# Altium project soldering_station.PrjPcb
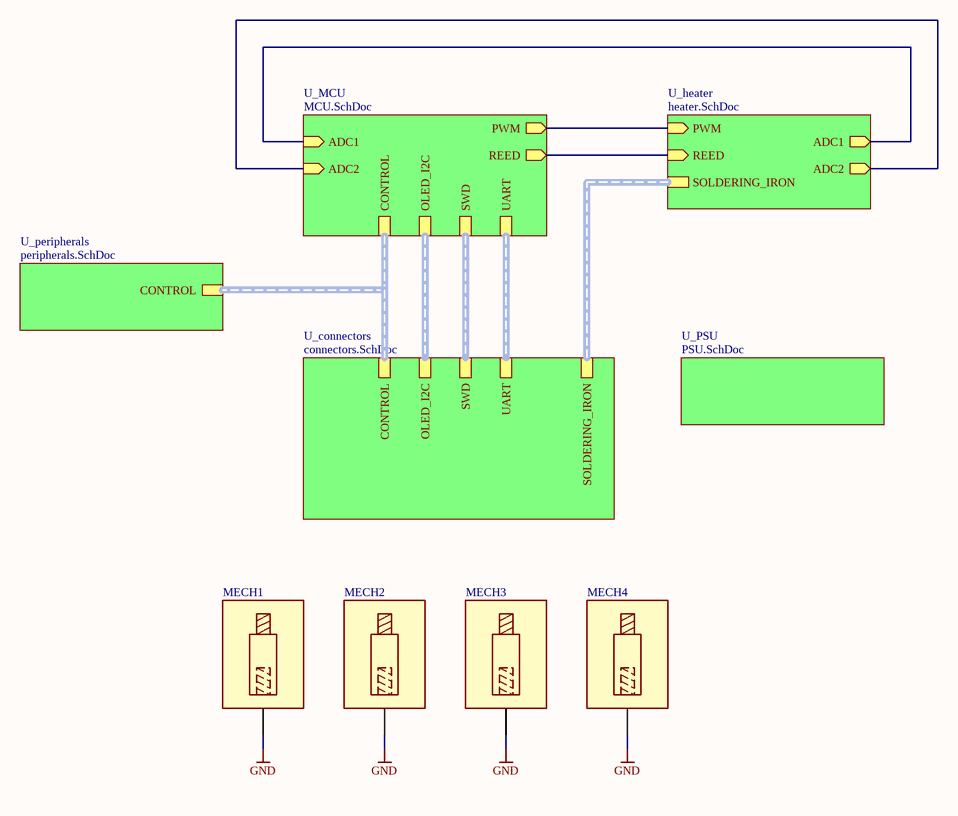
[diagram p0: top.SchDoc]
6 sheets, 88 parts. Net scope: hierarchical (ports join the sheet entries above them; power ports are global).
Board file: soldering_station.PcbDoc
Sheets:
  top.SchDoc
    U_PSU = PSU.SchDoc
    U_MCU = MCU.SchDoc
    U_connectors = connectors.SchDoc
    U_heater = heater.SchDoc
    U_peripherals = peripherals.SchDoc

## Sheet top.SchDoc
size A4

### Parts
MECH1  M3X0.5  [MECH_SPACER_MALE_FEMALE_18MM_M3]  (value not drawn)
MECH2  M3X0.5  [MECH_SPACER_MALE_FEMALE_18MM_M3]  (value not drawn)
MECH3  M3X0.5  [MECH_SPACER_MALE_FEMALE_18MM_M3]  (value not drawn)
MECH4  M3X0.5  [MECH_SPACER_MALE_FEMALE_18MM_M3]  (value not drawn)

### Sub-sheets
U_connectors = connectors.SchDoc: SWD (harness SWD), CONTROL (harness CONTROL), OLED_I2C (harness OLED_I2C), UART (harness UART), SOLDERING_IRON (harness SOLDERING_IRON)
U_heater = heater.SchDoc: PWM (in), ADC2 (out), ADC1 (out), SOLDERING_IRON (harness SOLDERING_IRON), REED (in)
U_MCU = MCU.SchDoc: SWD (harness SWD), PWM (out), CONTROL (harness CONTROL), OLED_I2C (harness OLED_I2C), UART (harness UART), ADC2 (in), ADC1 (in), REED (out)
U_peripherals = peripherals.SchDoc: CONTROL (harness CONTROL)
U_PSU = PSU.SchDoc: no entries

### Nets
GND: MECH1.1 MECH2.1 MECH3.1 MECH4.1
PWM_OUT: sheet U_MCU/PWM, sheet U_heater/PWM
REED: sheet U_MCU/REED, sheet U_heater/REED
TR: sheet U_MCU/ADC2, sheet U_heater/ADC2
NetR9_2: sheet U_MCU/ADC1, sheet U_heater/ADC1

### Buses and harness runs
harness sheet U_connectors/CONTROL = sheet U_MCU/CONTROL = sheet U_peripherals/CONTROL
harness sheet U_connectors/OLED_I2C = sheet U_MCU/OLED_I2C
harness sheet U_connectors/SOLDERING_IRON = sheet U_heater/SOLDERING_IRON
harness sheet U_connectors/SWD = sheet U_MCU/SWD
harness sheet U_connectors/UART = sheet U_MCU/UART

### Library data of the parts
MECH1-MECH4 = MECH_SPACER_MALE_FEMALE_18MM_M3: Manufacturer: FIX&FASTEN; Value: TP-18; SCH_Footprint: M3; Part Number: MECH_SPACER_MALE_FEMALE_18MM_M3; HelpURL: http://www.tme.eu/pl/Document/c63f116060195082d899531b8f30ddf7/TP-10.pdf; Manufacturer Part Number: TP-18; Supplier 1: TME; Supplier Part Number 1: TP-18; Supplier 2: RS Components; Supplier 3: Farnell; Supplier 4: Mouser; Supplier 5: Digi-Key

## Sheet PSU.SchDoc
size A4
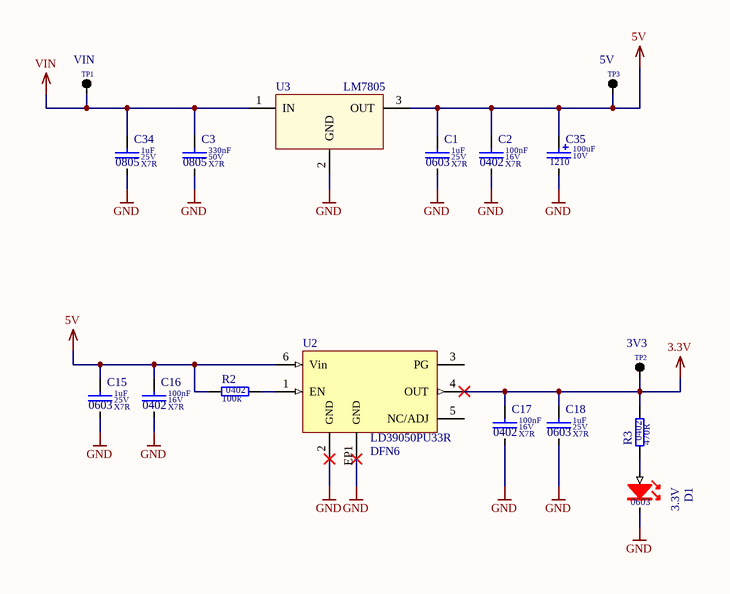
[diagram p1: PSU.SchDoc]

### Parts
C1  value 1uF  Dielectric: X7R  Voltage: 25V  SCH_Footprint: 0603  [C_0603_1608]  (hidden comment: Ceramic X7R)
C2  value 100nF  Dielectric: X7R  Voltage: 16V  SCH_Footprint: 0402  [C_0402_1005]  (hidden comment: Ceramic X7R)
C3  value 330nF  Dielectric: X7R  Voltage: 50V  SCH_Footprint: 0805  [C_0805_2012]  (hidden comment: Ceramic X7R)
C15  value 1uF  Dielectric: X7R  Voltage: 25V  SCH_Footprint: 0603  [C_0603_1608]  (hidden comment: Ceramic X7R)
C16  value 100nF  Dielectric: X7R  Voltage: 16V  SCH_Footprint: 0402  [C_0402_1005]  (hidden comment: Ceramic X7R)
C17  value 100nF  Dielectric: X7R  Voltage: 16V  SCH_Footprint: 0402  [C_0402_1005]  (hidden comment: Ceramic X7R)
C18  value 1uF  Dielectric: X7R  Voltage: 25V  SCH_Footprint: 0603  [C_0603_1608]  (hidden comment: Ceramic X7R)
C34  value 1uF  Dielectric: X7R  Voltage: 25V  SCH_Footprint: 0805  [C_0805_2012]  (hidden comment: Ceramic X7R)
C35  value 100uF  SCH_Footprint: 1210  Voltage: 10V  [CT_1210_3225]  (hidden comment: Tantalum Capacitor)
D1  3.3V  SCH_Footprint: 0603  [OL_0603_1608]
R2  value 100k  SCH_Footprint: 0402  [R_0402_1005]  (hidden comment: Resistor)
R3  value 470R  SCH_Footprint: 0402  [R_0402_1005]  (hidden comment: Resistor)
TP1  VIN  [TP_PAD]
TP2  3V3  [TP_PAD]
TP3  5V  [TP_PAD]
U2  SCH_Footprint: DFN6  [DFN6_3x3]  (hidden comment: LD39050PU33R)
U3  LM7805  [LM7805]

### Nets
3.3V: C17.1 C18.1 R3.2 TP2.1(TP) U2.4(OUT)
5V: C1.1 C2.1 C15.1 C16.1 C35.1 R2.1 TP3.1(TP) U2.6(Vin) U3.3(OUT)
GND: C1.2 C2.2 C3.2 C15.2 C16.2 C17.2 C18.2 C34.2 C35.2 D1.1(K) U2.2(GND) U2.EP1(GND) U3.2(GND)
VIN: C3.1 C34.1 TP1.1(TP) U3.1(IN)
NetD1_2: D1.2(A) R3.1
NetR2_2: R2.2 U2.1(EN)

Not connected (* = marked no-connect by the designer): U2 3(PG) 5(NC/ADJ)

### Library data of the parts
C1 C15 C18 = C_1uF_25V_X7R_0603_10: Capacitor; Manufacturer: Samsung; Manufacturer Part Number: CL10B105KA8NNNC; Tolerance (%): 10; Part Number: C_1uF_25V_X7R_0603_10; HelpURL: http://www.tme.eu/pl/Document/4a42202b32dab16128fe107dd69598cc/samsung-chip-cap.pdf; Supplier 1: TME; Supplier Part Number 1: CL10B105KA8NNNC; Supplier 2: RS Components; Supplier 3: Farnell; Supplier 4: Mouser; Supplier 5: Digi-Key
C2 C16 C17 = C_100nF_16V_X7R_0402_10: Capacitor; Manufacturer: Murata; Manufacturer Part Number: GRM155R71C104KA88D; Tolerance (%): 10; Part Number: C_100nF_16V_X7R_0402_10; HelpURL: https://www.mouser.com/ds/2/281/c02e-2905.pdf; Supplier 1: TME; Supplier 2: RS Components; Supplier 3: Farnell; Supplier 4: Mouser; Supplier Part Number 4: 81-GRM155R71C104KA88; Supplier 5: Digi-Key
C3 C34 = C_2.2uF_25V_X7R_0805_10: Capacitor; Manufacturer: Murata; Manufacturer Part Number: GCM21BR71E225KA73L; Tolerance (%): 10; Part Number: C_2.2uF_25V_X7R_0805_10; HelpURL: http://www.tme.eu/pl/Document/8ba767cb01dfa0e767d35427fa0d0fc6/GCM21BR71E225KA73-01.pdf; Supplier 1: TME; Supplier Part Number 1: GCM21BR71E225KA73L; Supplier 2: RS Components; Supplier Part Number 2: 7235045; Supplier 3: Farnell; Supplier Part Number 3: 2470436; Supplier 4: Mouser; Supplier Part Number 4: 81-81-GCM21BR71E225KA3L; Supplier 5: Digi-Key; Supplier Part Number 5: 490-4787-1-ND
C35 = CT_100uF_10V_TA2O5_1210_20: Capacitor; Manufacturer: AVX; Manufacturer Part Number: TAJB107M010RNJ; Dielectric: TA2O5; Tolerance (%): 20; Part Number: CT_100uF_10V_TA2O5_1210_20; HelpURL: https://datasheet.octopart.com/TAJB107M010RNJ-AVX-datasheet-12511273.pdf; Supplier 1: TME; Supplier Part Number 1: TAJB107M010R; Supplier 2: RS Components; Supplier Part Number 2: 1360118; Supplier 3: Farnell; Supplier Part Number 3: 1658150; Supplier 4: Mouser; Supplier Part Number 4: 581-TAJB107M010R; Supplier 5: Digi-Key; Supplier Part Number 5: 478-5801-1-ND
D1 = OL_R_0603: LED_RED; Manufacturer: Lite-On; Value: LTST-C190KRKT; Part Number: OL_R_0603; HelpURL: https://datasheet.octopart.com/LTST-C190KRKT-Lite-On-datasheet-158191.pdf; Manufacturer Part Number: LTST-C190KRKT; Supplier 1: TME; Supplier Part Number 1: LTST-C190KRKT; Supplier 2: RS Components; Supplier Part Number 2: 1769795; Supplier 3: Farnell; Supplier 4: Mouser; Supplier Part Number 4: 859-LTST-C190KRKT; Supplier 5: Digi-Key; Supplier Part Number 5: 160-1436-1-ND
R2 = R_100k_0402_1: Manufacturer: Yageo; Manufacturer Part Number: RC0402FR-07100KL; Voltage: 50V; Power: 63mW; Tolerance: 1%; Part Number: R_100k_0402_1; HelpURL: http://www.tme.eu/pl/Document/1a2bc76e2be68b3b1670068306778ce6/rc0402yageo.pdf; Supplier 1: TME; Supplier Part Number 1: RC0402FR-07100K; Supplier 2: RS Components; Supplier 3: Farnell; Supplier Part Number 3: 2131798; Supplier 4: Mouser; Supplier Part Number 4: 603-RC0402FR-07100KL; Supplier 5: Digi-Key; Supplier Part Number 5: 311-100KLRCT-ND
R3 = R_470R_0402_1: Manufacturer: Yageo; Manufacturer Part Number: RC0402FR-07470RL; Voltage: 50V; Power: 63mW; Tolerance: 1%; Part Number: R_470R_0402_1; HelpURL: http://datasheet.octopart.com/RC0402FR-07470RL-Yageo-datasheet-10408619.pdf; Supplier 1: TME; Supplier Part Number 1: RC0402FR-07470R; Supplier 2: RS Components; Supplier 3: Farnell; Supplier Part Number 3: 9239197; Supplier 4: Mouser; Supplier Part Number 4: 603-RC0402FR-07470RL; Supplier 5: Digi-Key; Supplier Part Number 5: 311-470LRCT-ND
TP1-TP3 = TP_PAD: Testpoint; SCH_Footprint: SMD; Part Number: TP_PAD; Component Type: Standard (No BOM); Supplier 1: TME; Supplier 2: RS Components; Supplier 3: Farnell; Supplier 4: Mouser; Supplier 5: Digi-Key
U2 = VL_LD39050PU33R: Manufacturer: STMicroelectronics; Voltage: 3.3V; Current: 500mA; Value: LD39050PU33R; Part Number: VL_LD39050PU33R; HelpURL: https://www.tme.eu/pl/Document/062513da0f421ddb82a14a498f7bf1c8/LD39050.pdf; Manufacturer Part Number: LD39050PU33R; Supplier 1: TME; Supplier Part Number 1: LD39050PU33R; Supplier 2: RS Components; Supplier 3: Farnell; Supplier Part Number 3: 2762703; Supplier 4: Mouser; Supplier Part Number 4: 511-LD39050PU33R; Supplier 5: Digi-Key; Supplier Part Number 5: 497-8716-1-ND
U3 = LM7805: linear voltage stabilizer

## Sheet MCU.SchDoc
size A4
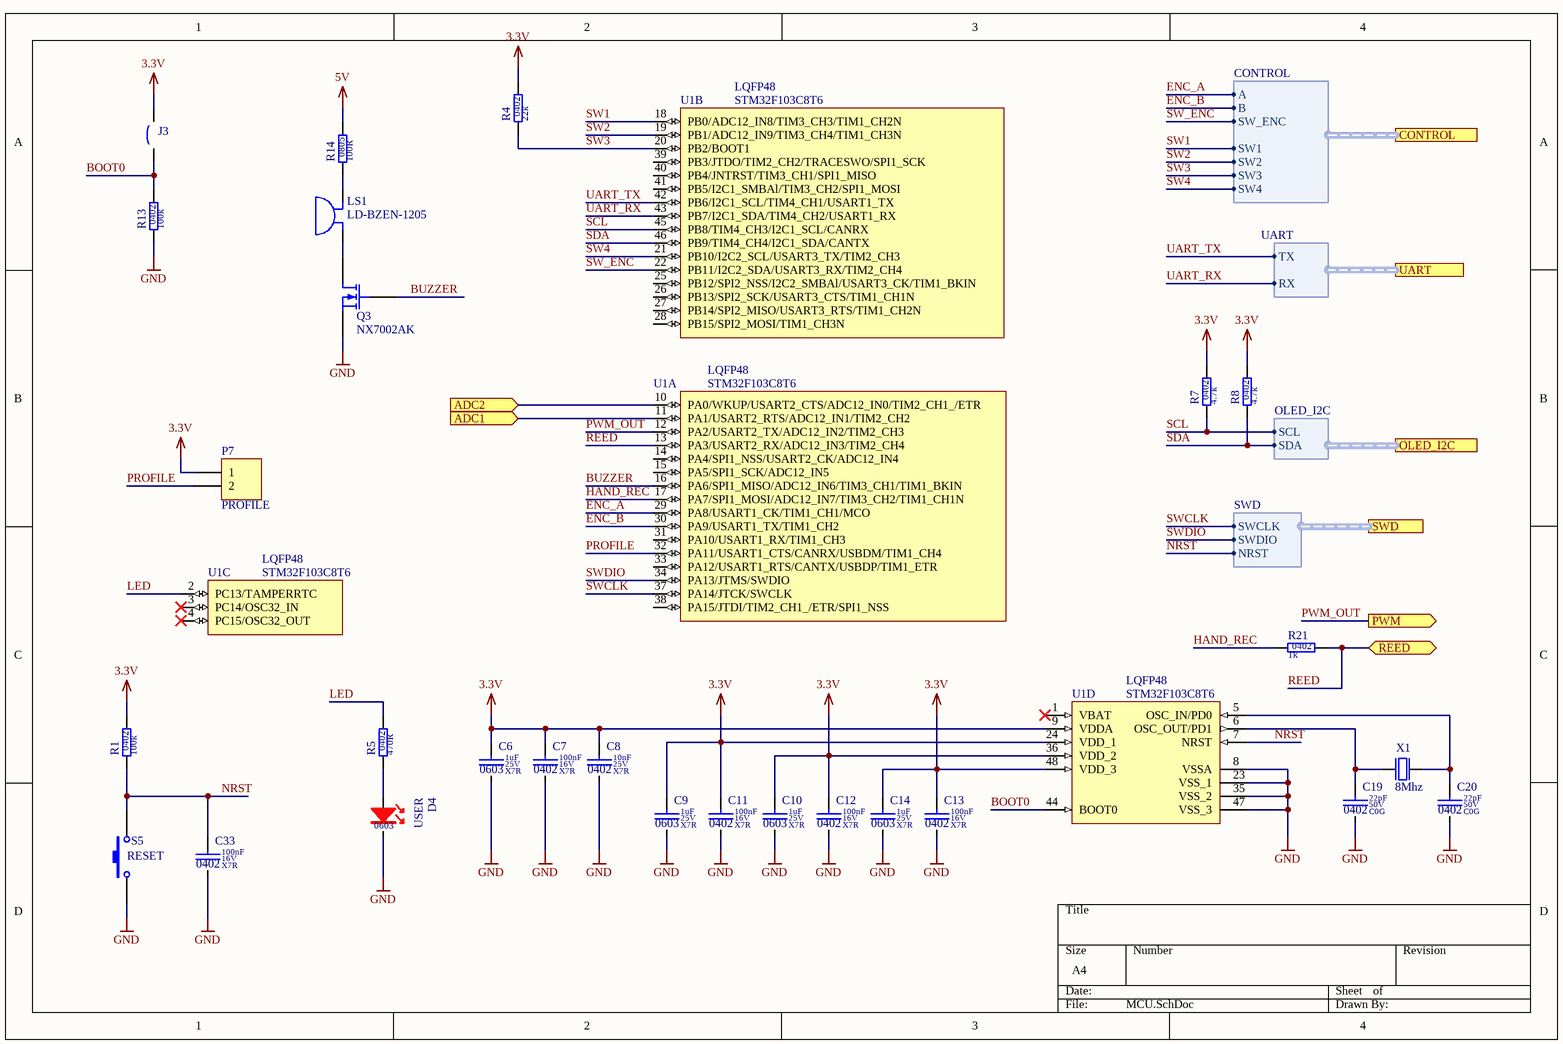
[diagram p2: MCU.SchDoc]

### Parts
C6  value 1uF  Dielectric: X7R  Voltage: 25V  SCH_Footprint: 0603  [C_0603_1608]  (hidden comment: Ceramic X7R)
C7  value 100nF  Dielectric: X7R  Voltage: 16V  SCH_Footprint: 0402  [C_0402_1005]  (hidden comment: Ceramic X7R)
C8  value 10nF  Dielectric: X7R  Voltage: 25V  SCH_Footprint: 0402  [C_0402_1005]  (hidden comment: Ceramic X7R)
C9  value 1uF  Dielectric: X7R  Voltage: 25V  SCH_Footprint: 0603  [C_0603_1608]  (hidden comment: Ceramic X7R)
C10  value 1uF  Dielectric: X7R  Voltage: 25V  SCH_Footprint: 0603  [C_0603_1608]  (hidden comment: Ceramic X7R)
C11  value 100nF  Dielectric: X7R  Voltage: 16V  SCH_Footprint: 0402  [C_0402_1005]  (hidden comment: Ceramic X7R)
C12  value 100nF  Dielectric: X7R  Voltage: 16V  SCH_Footprint: 0402  [C_0402_1005]  (hidden comment: Ceramic X7R)
C13  value 100nF  Dielectric: X7R  Voltage: 16V  SCH_Footprint: 0402  [C_0402_1005]  (hidden comment: Ceramic X7R)
C14  value 1uF  Dielectric: X7R  Voltage: 25V  SCH_Footprint: 0603  [C_0603_1608]  (hidden comment: Ceramic X7R)
C19  value 22pF  Dielectric: C0G  Voltage: 50V  SCH_Footprint: 0402  [C_0402_1005]  (hidden comment: Ceramic C0G)
C20  value 22pF  Dielectric: C0G  Voltage: 50V  SCH_Footprint: 0402  [C_0402_1005]  (hidden comment: Ceramic C0G)
C33  value 100nF  Dielectric: X7R  Voltage: 16V  SCH_Footprint: 0402  [C_0402_1005]  (hidden comment: Ceramic X7R)
D4  USER  SCH_Footprint: 0603  [OL_0603_1608]
J3  BOOT0  [Contact_Point_2_Pad]  (value not drawn)
LS1  LD-BZEN-1205  [LD-BZEN-1205]
P7  PROFILE  [P_HEADER_1x2_2.54]
Q3  NX7002AK  [NX7002AK.215]
R1  value 100k  SCH_Footprint: 0402  [R_0402_1005]  (hidden comment: Resistor)
R4  value 22k  SCH_Footprint: 0402  [R_0402_1005]  (hidden comment: Resistor)
R5  value 470R  SCH_Footprint: 0402  [R_0402_1005]  (hidden comment: Resistor)
R7  value 4.7k  SCH_Footprint: 0402  [R_0402_1005]  (hidden comment: Resistor)
R8  value 4.7k  SCH_Footprint: 0402  [R_0402_1005]  (hidden comment: Resistor)
R13  value 100k  SCH_Footprint: 0402  [R_0402_1005]  (hidden comment: Resistor)
R14  value 100R  SCH_Footprint: 0805  [R_0805_2012]  (hidden comment: Resistor)
R21  value 1k  SCH_Footprint: 0402  [R_0402_1005]  (hidden comment: Resistor)
S5  RESET  [S_TACTSWITCH3x6]
U1  SCH_Footprint: LQFP48  [LQFP48_7x7]  (hidden comment: STM32F103C8T6)  (parts A,B,C,D of 4)
X1  8MHz  [X_HC49_THT]

### Ports
ADC1 (in), ADC2 (in), CONTROL (harness CONTROL), OLED_I2C (harness OLED_I2C), PWM (out), REED (bidir), SWD (harness SWD), UART (harness UART)

### Harnesses
SWD: SWCLK, NRST, SWDIO
CONTROL: A, B, SW_ENC, SW1, SW2, SW3, SW4
OLED_I2C: SCL, SDA
UART: TX, RX

### Nets
3.3V: C6.1 C7.1 C8.1 C9.1 C10.1 C11.1 C12.1 C13.1 C14.1 J3.2 P7.1 R1.2 R4.2 R7.2 R8.2 U1.9(VDDA) U1.24(VDD_1) U1.36(VDD_2) U1.48(VDD_3)
5V: R14.2
GND: C6.2 C7.2 C8.2 C9.2 C10.2 C11.2 C12.2 C13.2 C14.2 C19.2 C20.2 C33.2 D4.1(K) Q3.2(S) R13.1 S5.1 U1.8(VSSA) U1.23(VSS_1) U1.35(VSS_2) U1.47(VSS_3)
BOOT0: J3.1 R13.2 U1.44(BOOT0)
BUZZER: Q3.1(G) U1.16(PA6/SPI1_MISO/ADC12_IN6/TIM3_CH1/TIM1_BKIN)
ENC_A: U1.29(PA8/USART1_CK/TIM1_CH1/MCO) ; port CONTROL.A
ENC_B: U1.30(PA9/USART1_TX/TIM1_CH2) ; port CONTROL.B
HAND_REC: R21.1 U1.17(PA7/SPI1_MOSI/ADC12_IN7/TIM3_CH2/TIM1_CH1N)
LED: R5.2 U1.2(PC13/TAMPERRTC)
NRST: C33.1 R1.1 S5.2 U1.7(NRST) ; port SWD.NRST
PROFILE: P7.2 U1.32(PA11/USART1_CTS/CANRX/USBDM/TIM1_CH4)
PWM_OUT: U1.12(PA2/USART2_TX/ADC12_IN2/TIM2_CH3) ; port PWM
REED: R21.2 U1.13(PA3/USART2_RX/ADC12_IN3/TIM2_CH4) ; port REED
SCL: R7.1 U1.45(PB8/TIM4_CH3/I2C1_SCL/CANRX) ; port OLED_I2C.SCL
SDA: R8.1 U1.46(PB9/TIM4_CH4/I2C1_SDA/CANTX) ; port OLED_I2C.SDA
SW1: U1.18(PB0/ADC12_IN8/TIM3_CH3/TIM1_CH2N) ; port CONTROL.SW1
SW2: U1.19(PB1/ADC12_IN9/TIM3_CH4/TIM1_CH3N) ; port CONTROL.SW2
SW3: R4.1 U1.20(PB2/BOOT1) ; port CONTROL.SW3
SW4: U1.21(PB10/I2C2_SCL/USART3_TX/TIM2_CH3) ; port CONTROL.SW4
SW_ENC: U1.22(PB11/I2C2_SDA/USART3_RX/TIM2_CH4) ; port CONTROL.SW_ENC  [project net SW]
SWCLK: U1.37(PA14/JTCK/SWCLK) ; port SWD.SWCLK
SWDIO: U1.34(PA13/JTMS/SWDIO) ; port SWD.SWDIO
TR: U1.10(PA0/WKUP/USART2_CTS/ADC12_IN0/TIM2_CH1_/ETR) ; port ADC2
UART_RX: U1.43(PB7/I2C1_SDA/TIM4_CH2/USART1_RX) ; port UART.RX  [project net RX]
UART_TX: U1.42(PB6/I2C1_SCL/TIM4_CH1/USART1_TX) ; port UART.TX  [project net TX]
NetC19_1: C19.1 U1.6(OSC_OUT/PD1) X1.1
NetC20_1: C20.1 U1.5(OSC_IN/PD0) X1.2
NetD4_2: D4.2(A) R5.1
NetLS1_1: LS1.1 R14.1
NetLS1_2: LS1.2 Q3.3(D)
NetR9_2: U1.11(PA1/USART2_RTS/ADC12_IN1/TIM2_CH2) ; port ADC1

Not connected (* = marked no-connect by the designer): U1 1(VBAT)* 3(PC14/OSC32_IN)* 4(PC15/OSC32_OUT)* 14(PA4/SPI1_NSS/USART2_CK/ADC12_IN4) 15(PA5/SPI1_SCK/ADC12_IN5) 25(PB12/SPI2_NSS/I2C2_SMBAl/USART3_CK/TIM1_BKIN) 26(PB13/SPI2_SCK/USART3_CTS/TIM1_CH1N) 27(PB14/SPI2_MISO/USART3_RTS/TIM1_CH2N) 28(PB15/SPI2_MOSI/TIM1_CH3N) 31(PA10/USART1_RX/TIM1_CH3) 33(PA12/USART1_RTS/CANTX/USBDP/TIM1_ETR) 38(PA15/JTDI/TIM2_CH1_/ETR/SPI1_NSS) 39(PB3/JTDO/TIM2_CH2/TRACESWO/SPI1_SCK) 40(PB4/JNTRST/TIM3_CH1/SPI1_MISO) 41(PB5/I2C1_SMBAl/TIM3_CH2/SPI1_MOSI)

### Library data of the parts
C6 C9 C10 C14 = C_1uF_25V_X7R_0603_10: as C1 on sheet PSU; Part Number: C_1uF_25V_X7R_0603_10; HelpURL: http://www.tme.eu/pl/Document/4a42202b32dab16128fe107dd69598cc/samsung-chip-cap.pdf; Supplier 1: TME; Supplier Part Number 1: CL10B105KA8NNNC; Supplier 2: RS Components; Supplier 3: Farnell; Supplier 4: Mouser; Supplier 5: Digi-Key
C7 C11-C13 C33 = C_100nF_16V_X7R_0402_10: as C2 on sheet PSU; Part Number: C_100nF_16V_X7R_0402_10; HelpURL: https://www.mouser.com/ds/2/281/c02e-2905.pdf; Supplier 1: TME; Supplier 2: RS Components; Supplier 3: Farnell; Supplier 4: Mouser; Supplier Part Number 4: 81-GRM155R71C104KA88; Supplier 5: Digi-Key
C8 = C_10nF_25V_X7R_0402_10: Capacitor; Manufacturer: Murata; Manufacturer Part Number: GRM155R71E103KA01D; Tolerance (%): 10; Part Number: C_10nF_25V_X7R_0402_10; HelpURL: http://www.tme.eu/en/Document/e3e731e59cc68b1ab6d46b158bb05733/MURATA_GRM.pdf; Supplier 1: TME; Supplier Part Number 1: GRM155R71E103KA01D; Supplier 2: RS Components; Supplier Part Number 2: 6242301; Supplier 3: Farnell; Supplier Part Number 3: 8819734; Supplier 4: Mouser; Supplier Part Number 4: 81-GRM36X103K25; Supplier 5: Digi-Key; Supplier Part Number 5: 490-1312-1-ND
C19 C20 = C_22pF_50V_C0G_0402_5: Capacitor; Manufacturer: AVX; Manufacturer Part Number: 04025A220JAT2A; Tolerance (%): 5; Part Number: C_22pF_50V_C0G_0402_5; HelpURL: http://datasheet.octopart.com/04025A220JAT2A-AVX-datasheet-9883399.pdf; Supplier 1: TME; Supplier Part Number 1: 04025A220JAT2A; Supplier 2: RS Components; Supplier Part Number 2: 6983087; Supplier 3: Farnell; Supplier Part Number 3: 2280776; Supplier 4: Mouser; Supplier Part Number 4: 581-04025A220J; Supplier 5: Digi-Key; Supplier Part Number 5: 478-1074-1-ND
D4 = OL_R_0603: as D1 on sheet PSU; Part Number: OL_R_0603; HelpURL: https://datasheet.octopart.com/LTST-C190KRKT-Lite-On-datasheet-158191.pdf; Manufacturer Part Number: LTST-C190KRKT; Supplier 1: TME; Supplier Part Number 1: LTST-C190KRKT; Supplier 2: RS Components; Supplier Part Number 2: 1769795; Supplier 3: Farnell; Supplier 4: Mouser; Supplier Part Number 4: 859-LTST-C190KRKT; Supplier 5: Digi-Key; Supplier Part Number 5: 160-1436-1-ND
J3 = Contact_Point_2_Pad
LS1 = LD-BZEN-1205: Przetwornik dźwięku: elektromagnetyczny; THT; 2,4kHz; 40mA; H: 9mm
P7 = P_HEADER_1x2_2.54: Header, 2-Pin; Manufacturer: Connfly; Value: DS1021-1*2SF1-1; SCH_Footprint: 1x2 2.54mm; Part Number: P_HEADER_1x2_2.54; Component Type: Standard; HelpURL: http://www.tme.eu/en/Document/cc301e58a5da78cb543a94b5a5b7f06a/DS1021.pdf; Manufacturer Part Number: DS1021-1*2SF1-1; Supplier 1: TME; Supplier Part Number 1: ZL201-02G; Supplier 2: RS Components; Supplier 3: Farnell; Supplier 4: Mouser; Supplier 5: Digi-Key
Q3 = NX7002AK.215: Tranzystor: N-MOSFET; unipolarny; 60V; 0,12A; 325mW; SOT23
R1 R7 R8 R13 = R_100k_0402_1: as R2 on sheet PSU; Part Number: R_100k_0402_1; HelpURL: http://www.tme.eu/pl/Document/1a2bc76e2be68b3b1670068306778ce6/rc0402yageo.pdf; Supplier 1: TME; Supplier Part Number 1: RC0402FR-07100K; Supplier 2: RS Components; Supplier 3: Farnell; Supplier Part Number 3: 2131798; Supplier 4: Mouser; Supplier Part Number 4: 603-RC0402FR-07100KL; Supplier 5: Digi-Key; Supplier Part Number 5: 311-100KLRCT-ND
R4 = R_22k_0402_1: Manufacturer: Panasonic; Manufacturer Part Number: ERA-2AEB223X; Voltage: 50V; Power: 63mW; Tolerance: 1%; Part Number: R_22k_0402_1; HelpURL: http://www.mouser.com/ds/2/315/AOA0000C237-1100991.pdf; Supplier 1: TME; Supplier 2: RS Components; Supplier Part Number 2: 566557; Supplier 3: Farnell; Supplier Part Number 3: 1577719; Supplier 4: Mouser; Supplier Part Number 4: 667-ERA-2AEB223X; Supplier 5: Digi-Key; Supplier Part Number 5: P22KDCCT-ND
R5 = R_470R_0402_1: as R3 on sheet PSU; Part Number: R_470R_0402_1; HelpURL: http://datasheet.octopart.com/RC0402FR-07470RL-Yageo-datasheet-10408619.pdf; Supplier 1: TME; Supplier Part Number 1: RC0402FR-07470R; Supplier 2: RS Components; Supplier 3: Farnell; Supplier Part Number 3: 9239197; Supplier 4: Mouser; Supplier Part Number 4: 603-RC0402FR-07470RL; Supplier 5: Digi-Key; Supplier Part Number 5: 311-470LRCT-ND
R14 = R_100R_0805_1: Manufacturer: Yageo; Manufacturer Part Number: RC0805FR-07100RL; Voltage: 150V; Power: 125mW; Tolerance: 1%; Part Number: R_100R_0805_1; HelpURL: https://www.tme.eu/pl/Document/7b8fed8c112f8a94930279c22c957f7f/rc0805yageo.pdf; Supplier 1: TME; Supplier Part Number 1: RC0805FR-07100R; Supplier 2: RS Components; Supplier Part Number 2: 618-5135; Supplier 3: Farnell; Supplier Part Number 3: 9237364; Supplier 4: Mouser; Supplier Part Number 4: 603-RC0805FR-07100RL; Supplier 5: Digi-Key; Supplier Part Number 5: 311-100CRCT-ND
R21 = R_1k_0402_1: Manufacturer: Yageo; Manufacturer Part Number: RC0402FR-071K; Voltage: 50V; Power: 63mW; Tolerance: 1%; Part Number: R_1k_0402_1; HelpURL: http://www.tme.eu/pl/Document/1a2bc76e2be68b3b1670068306778ce6/rc0402yageo.pdf; Supplier 1: TME; Supplier Part Number 1: RC0402FR-071K; Supplier 2: RS Components; Supplier 3: Farnell; Supplier Part Number 3: 9239235; Supplier 4: Mouser; Supplier Part Number 4: 603-RC0402FR-071KP; Supplier 5: Digi-Key; Supplier Part Number 5: 311-1.00KLRCT-ND
S5 = S_TACTSWITCH: Tact Switch; Manufacturer: Ninigi; Manufacturer Part Number: TACTM-34N-F; SCH_Footprint: 3x6mm; Part Number: S_TACTSWITCH; Value: RESET; HelpURL: http://pl.ninigi.com/product/tactm-34n-f/pdf; Supplier 1: TME; Supplier Part Number 1: TACTM-34N-F; Supplier 2: RS Components; Supplier 3: Farnell; Supplier 4: Mouser; Supplier 5: Digi-Key
U1 = UP_STM32F103C8T6: Manufacturer: STMicroelectronics; Value: STM32F103C8T6; Part Number: UP_STM32F103C8T6; HelpURL: https://datasheet.octopart.com/STM32F103C8T6-STMicroelectronics-datasheet-48026265.pdf; Manufacturer Part Number: STM32F103C8T6; Supplier 1: TME; Supplier Part Number 1: STM32F103C8T6; Supplier 2: RS Components; Supplier Part Number 2: 1023545; Supplier 3: Farnell; Supplier Part Number 3: 1447637; Supplier 4: Mouser; Supplier Part Number 4: 511-STM32F103C8T6; Supplier 5: Digi-Key; Supplier Part Number 5: 497-6063-ND
X1 = X_HC49US-FF5F18-16.0000: Resonator Ceramic; Manufacturer Part Number: HC49US-FF3F18-16.0000; Manufacturer: Ilsi; SCH_Footprint: HC49 THT; Part Number: X_HC49US-FF5F18-16.0000; Value: 8Mhz; HelpURL: http://www.tme.eu/pl/Document/6c671fc2d1c29550257ca2d207d0534f/HC49US_Series.pdf; Supplier 1: TME; Supplier Part Number 1: HC49US-FF5F16.0000; Supplier 2: RS Components; Supplier 3: Farnell; Supplier 4: Mouser; Supplier 5: Digi-Key

## Sheet connectors.SchDoc
size A4
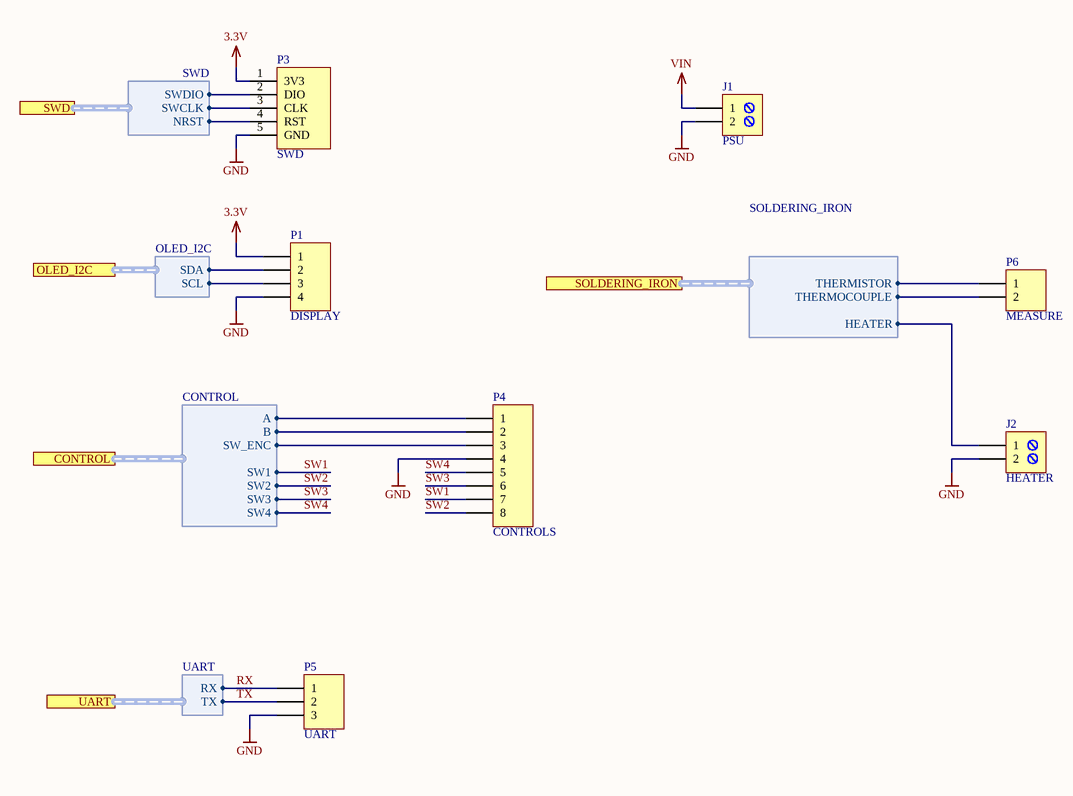
[diagram p3: connectors.SchDoc]

### Parts
J1  PSU  [J_ARK2]
J2  HEATER  [J_ARK2]
P1  DISPLAY  [P_HEADER_1x4_2.54]
P3  SWD  [SWD_Header]
P4  CONTROLS  [P_HEADER_1x8_2.54]
P5  UART  [P_HEADER_1x3_2.54]
P6  MEASURE  [P_HEADER_1x2_2.54]

### Ports
CONTROL (harness CONTROL), OLED_I2C (harness OLED_I2C), SOLDERING_IRON (harness SOLDERING_IRON), SWD (harness SWD), UART (harness UART)

### Harnesses
OLED_I2C: SDA, SCL
SWD: NRST, SWCLK, SWDIO
CONTROL: A, B, SW_ENC, SW1, SW2, SW3, SW4
UART: RX, TX
SOLDERING_IRON: HEATER, THERMISTOR, THERMOCOUPLE

### Nets
3.3V: P1.1 P3.1(3V3)
GND: J1.2 J2.2 P1.4 P3.5(GND) P4.4 P5.3
VIN: J1.1
ENC_A: P4.1 ; port CONTROL.A
ENC_B: P4.2 ; port CONTROL.B
HEATER: J2.1 ; port SOLDERING_IRON.HEATER
NRST: P3.4(RST) ; port SWD.NRST
REED: P6.2 ; port SOLDERING_IRON.THERMOCOUPLE
RX: P5.1 ; port UART.RX
SCL: P1.3 ; port OLED_I2C.SCL
SDA: P1.2 ; port OLED_I2C.SDA
SW: P4.3 ; port CONTROL.SW_ENC
SW1: P4.7 ; port CONTROL.SW1
SW2: P4.8 ; port CONTROL.SW2
SW3: P4.6 ; port CONTROL.SW3
SW4: P4.5 ; port CONTROL.SW4
SWCLK: P3.3(CLK) ; port SWD.SWCLK
SWDIO: P3.2(DIO) ; port SWD.SWDIO
TR: P6.1 ; port SOLDERING_IRON.THERMISTOR
TX: P5.2 ; port UART.TX

### Library data of the parts
J1 J2 = J_TB-5.0-P-2P: ARK Screw terminal, 2-Pin; Manufacturer: DEGSON ELECTRONICS; Value: DG301-5.0-02P-12-18A(H); SCH_Footprint: ARK2; Part Number: J_TB-5.0-P-2P; Component Type: Standard; HelpURL: https://datasheet.octopart.com/DG301-5.0-03P-12-18A%28H%29-Degson-datasheet-17801202.pdf; Manufacturer Part Number: DG301-5.0-02P-12-18A(H); Supplier 1: TME; Supplier Part Number 1: DG301-5.0-2/6B; Supplier 2: RS Components; Supplier 3: Farnell; Supplier 4: Mouser; Supplier 5: Digi-Key
P1 = P_HEADER_1x4_2.54: Header, 4-Pin; Manufacturer: Connfly; Value: DS1021-1*4SF1-1; SCH_Footprint: 1x4 2.54mm; Part Number: P_HEADER_1x4_2.54; Component Type: Standard; HelpURL: http://datasheet.octopart.com/DS1021-1%2A4SF1-1-Connfly-datasheet-65537859.pdf; Manufacturer Part Number: DS1021-1*4SF1-1; Supplier 1: TME; Supplier Part Number 1: ZL201-04G; Supplier 2: RS Components; Supplier 3: Farnell; Supplier 4: Mouser; Supplier 5: Digi-Key
P3 = SWD_Header: 1x5 2.54 SWD Header
P4 = P_HEADER_1x8_2.54: Header, 8-Pin; Manufacturer: Connfly; Value: DS1021-1*8SF1-1; SCH_Footprint: 1x8 2.54mm; Part Number: P_HEADER_1x8_2.54; Component Type: Standard; HelpURL: http://www.tme.eu/en/Document/cc301e58a5da78cb543a94b5a5b7f06a/DS1021.pdf; Manufacturer Part Number: DS1021-1*8SF1-1; Supplier 1: TME; Supplier Part Number 1: ZL201-08G; Supplier 2: RS Components; Supplier 3: Farnell; Supplier 4: Mouser; Supplier 5: Digi-Key
P5 = P_HEADER_1x3_2.54: Header, 3-Pin; Manufacturer: Connfly; Value: DS1021-1*3SF1-1; SCH_Footprint: 1x3 2.54mm; Part Number: P_HEADER_1x3_2.54; Component Type: Standard; HelpURL: http://www.tme.eu/en/Document/cc301e58a5da78cb543a94b5a5b7f06a/DS1021.pdf; Manufacturer Part Number: DS1021-1*3SF1-1; Supplier 1: TME; Supplier Part Number 1: ZL201-03G; Supplier 2: RS Components; Supplier 3: Farnell; Supplier 4: Mouser; Supplier 5: Digi-Key
P6 = P_HEADER_1x2_2.54: as P7 on sheet MCU; Part Number: P_HEADER_1x2_2.54; Component Type: Standard; HelpURL: http://www.tme.eu/en/Document/cc301e58a5da78cb543a94b5a5b7f06a/DS1021.pdf; Manufacturer Part Number: DS1021-1*2SF1-1; Supplier 1: TME; Supplier Part Number 1: ZL201-02G; Supplier 2: RS Components; Supplier 3: Farnell; Supplier 4: Mouser; Supplier 5: Digi-Key

## Sheet heater.SchDoc
size A4
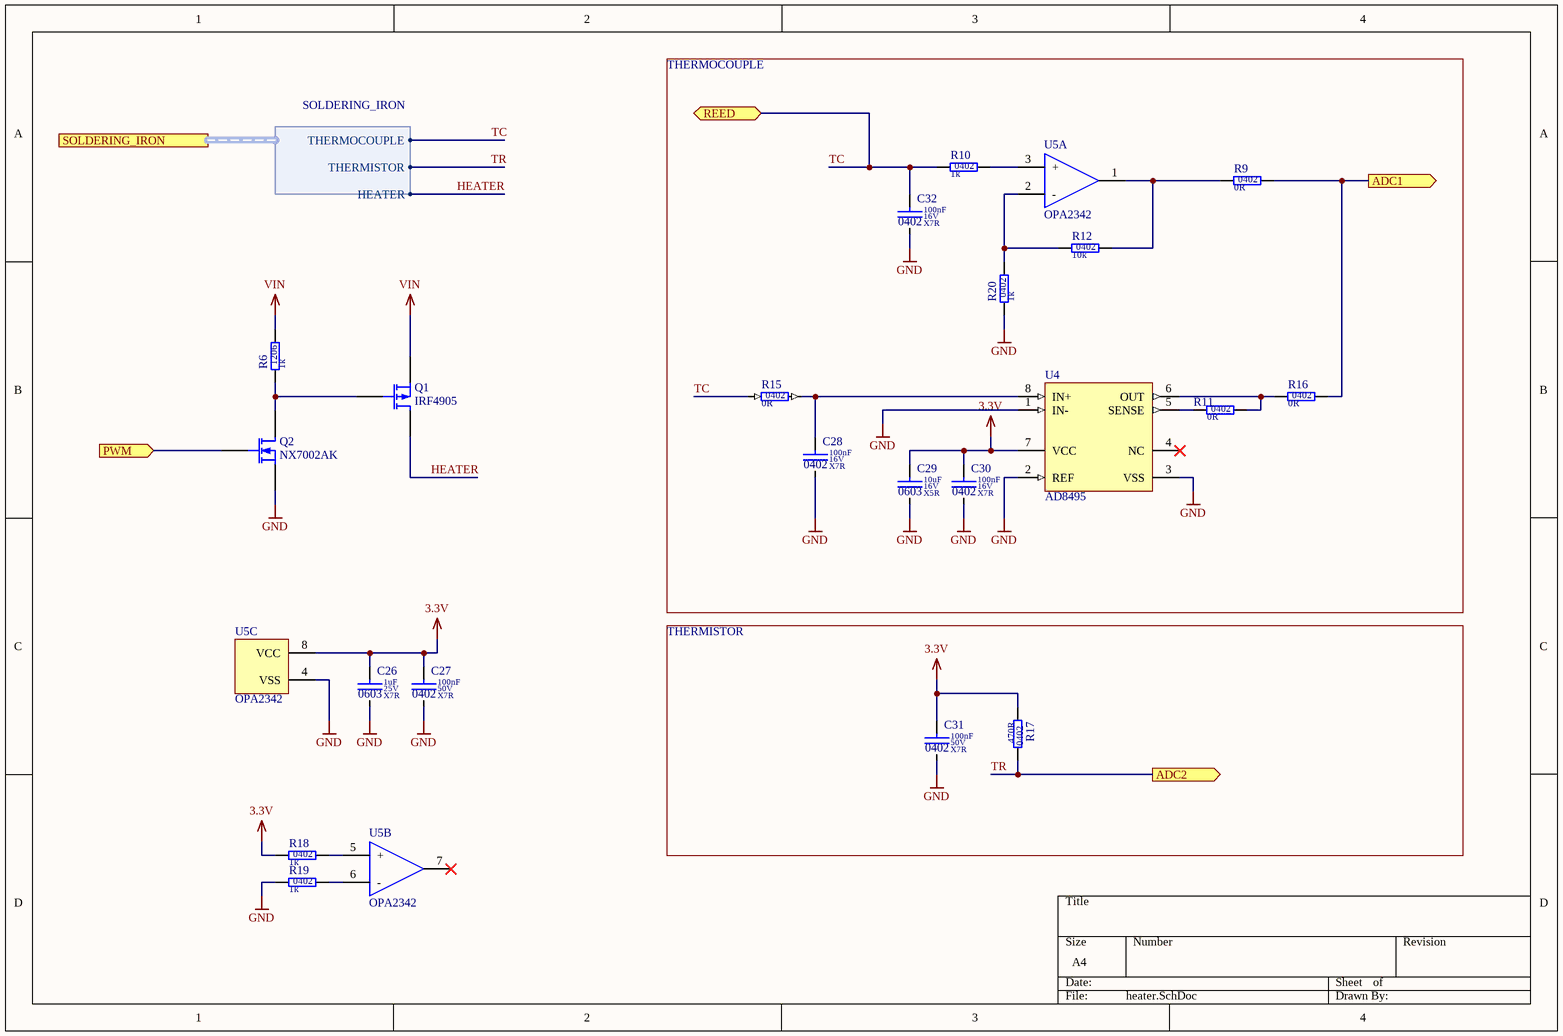
[diagram p4: heater.SchDoc]

### Parts
C26  value 1uF  Dielectric: X7R  Voltage: 25V  SCH_Footprint: 0603  [C_0603_1608]  (hidden comment: Ceramic X7R)
C27  value 100nF  Dielectric: X7R  Voltage: 50V  SCH_Footprint: 0402  [C_0402_1005]  (hidden comment: Ceramic X7R)
C28  value 100nF  Dielectric: X7R  Voltage: 16V  SCH_Footprint: 0402  [C_0402_1005]  (hidden comment: Ceramic X7R)
C29  value 10uF  Dielectric: X5R  Voltage: 16V  SCH_Footprint: 0603  [C_0603_1608]  (hidden comment: Ceramic X5R)
C30  value 100nF  Dielectric: X7R  Voltage: 16V  SCH_Footprint: 0402  [C_0402_1005]  (hidden comment: Ceramic X7R)
C31  value 100nF  Dielectric: X7R  Voltage: 50V  SCH_Footprint: 0402  [C_0402_1005]  (hidden comment: Ceramic X7R)
C32  value 100nF  Dielectric: X7R  Voltage: 16V  SCH_Footprint: 0402  [C_0402_1005]  (hidden comment: Ceramic X7R)
Q1  IRF4905  [IRF4905]
Q2  NX7002AK  [NX7002AK.215]
R6  value 1k  SCH_Footprint: 1206  [R_1206_3216]  (hidden comment: Resistor)
R9  value 0R  SCH_Footprint: 0402  [R_0402_1005]  (hidden comment: Resistor)
R10  value 1k  SCH_Footprint: 0402  [R_0402_1005]  (hidden comment: Resistor)
R11  value 0R  SCH_Footprint: 0402  [R_0402_1005]  (hidden comment: Resistor)
R12  value 10k  SCH_Footprint: 0402  [R_0402_1005]  (hidden comment: Resistor)
R15  value 0R  SCH_Footprint: 0402  [R_0402_1005]  (hidden comment: Resistor)
R16  value 0R  SCH_Footprint: 0402  [R_0402_1005]  (hidden comment: Resistor)
R17  value 470R  SCH_Footprint: 0402  [R_0402_1005]  (hidden comment: Resistor)
R18  value 1k  SCH_Footprint: 0402  [R_0402_1005]  (hidden comment: Resistor)
R19  value 1k  SCH_Footprint: 0402  [R_0402_1005]  (hidden comment: Resistor)
R20  value 1k  SCH_Footprint: 0402  [R_0402_1005]  (hidden comment: Resistor)
U4  AD8495  [AD8494]
U5  OPA2342  [OPA2342]  (parts A,B,C of 3)

### Blocks framed on the sheet
THERMOCOUPLE: C28-C30 C32 R9-R12 R15 R16 R20 U4 U5
THERMISTOR: C31 R17

### Ports
ADC1 (out), ADC2 (out), PWM (in), REED (bidir), SOLDERING_IRON (harness SOLDERING_IRON)

### Harnesses
SOLDERING_IRON: THERMOCOUPLE, THERMISTOR, HEATER

### Nets
3.3V: C26.1 C27.1 C29.1 C30.1 C31.1 R17.1 R18.1 U4.7(VCC) U5.8(VCC)
GND: C26.2 C27.2 C28.2 C29.2 C30.2 C31.2 C32.2 Q2.2(S) R19.1 R20.1 U4.1(IN-) U4.2(REF) U4.3(VSS) U5.4(VSS)
VIN: Q1.3(S) R6.2
HEATER: Q1.2(D) ; port SOLDERING_IRON.HEATER
PWM_OUT: Q2.1(G) ; port PWM
TC: C32.1 R10.1 R15.1 ; port REED, port SOLDERING_IRON.THERMOCOUPLE  [project net REED]
TR: R17.2 ; port ADC2, port SOLDERING_IRON.THERMISTOR
NetC28_1: C28.1 R15.2 U4.8(IN+)
NetQ1_1: Q1.1(G) Q2.3(D) R6.1
NetR9_1: R9.1 R12.2 U5.1(OUT)
NetR9_2: R9.2 R16.2 ; port ADC1
NetR10_2: R10.2 U5.3(+)
NetR11_1: R11.1 U4.5(SENSE)
NetR11_2: R11.2 R16.1 U4.6(OUT)
NetR12_1: R12.1 R20.2 U5.2(-)
NetR18_2: R18.2 U5.5(+)
NetR19_2: R19.2 U5.6(-)

Not connected (* = marked no-connect by the designer): U4 4(NC)*; U5 7(OUT)*

### Library data of the parts
C26 = C_1uF_25V_X7R_0603_10: as C1 on sheet PSU; Part Number: C_1uF_25V_X7R_0603_10; HelpURL: http://www.tme.eu/pl/Document/4a42202b32dab16128fe107dd69598cc/samsung-chip-cap.pdf; Supplier 1: TME; Supplier Part Number 1: CL10B105KA8NNNC; Supplier 2: RS Components; Supplier 3: Farnell; Supplier 4: Mouser; Supplier 5: Digi-Key
C27 C31 = C_100nF_50V_X7R_0402_10: Capacitor; Manufacturer: Murata; Manufacturer Part Number: GRM155R71H104KE14D; Tolerance (%): 10; Part Number: C_100nF_50V_X7R_0402_10; HelpURL: http://docs-europe.electrocomponents.com/webdocs/145f/0900766b8145f9d2.pdf; Supplier 1: TME; Supplier Part Number 1: GRM155R71H104KE14D; Supplier 2: RS Components; Supplier Part Number 2: 8847087; Supplier 3: Farnell; Supplier Part Number 3: 2611912; Supplier 4: Mouser; Supplier Part Number 4: 81-GRM155R71H104KE4D; Supplier 5: Digi-Key; Supplier Part Number 5: 490-10700-1-ND
C28 C30 C32 = C_100nF_16V_X7R_0402_10: as C2 on sheet PSU; Part Number: C_100nF_16V_X7R_0402_10; HelpURL: https://www.mouser.com/ds/2/281/c02e-2905.pdf; Supplier 1: TME; Supplier 2: RS Components; Supplier 3: Farnell; Supplier 4: Mouser; Supplier Part Number 4: 81-GRM155R71C104KA88; Supplier 5: Digi-Key
C29 = C_10uF_16V_X5R_0603_20: Capacitor; Manufacturer: Samsung Electro-Mechanics; Manufacturer Part Number: CL10A106MO8NQNC; Tolerance (%): 20; Part Number: C_10uF_16V_X5R_0603_20; HelpURL: http://www.tme.eu/pl/Document/4a42202b32dab16128fe107dd69598cc/samsung-chip-cap.pdf; Supplier 1: TME; Supplier Part Number 1: CL10A106MO8NQNC; Supplier 2: RS Components; Supplier 3: Farnell; Supplier 4: Mouser; Supplier 5: Digi-Key
Q1 = IRF4905: PMOS TO-220
Q2 = NX7002AK.215: as Q3 on sheet MCU
R6 = R_47k_1206_1: Manufacturer: Royalohm; Manufacturer Part Number: HP06W2F4702T5E; Voltage: 200V; Power: 500mW; Tolerance: 1%; Part Number: R_47k_1206_1; HelpURL: https://www.tme.eu/pl/Document/fa390a0a31e891a154d3713216995c6e/HighPowerHP.pdf; Supplier 1: TME; Supplier Part Number 1: HP06-47K1%; Supplier 2: RS Components; Supplier 3: Farnell; Supplier 4: Mouser; Supplier 5: Digi-Key
R9 R11 R15 R16 = R_0R_0402_5: Manufacturer: Rohm; Manufacturer Part Number: PMR01ZZPJ000; Voltage: 50V; Power: 100mW; Tolerance: 5%; Part Number: R_0R_0402_5; HelpURL: https://pl.mouser.com/datasheet/2/348/pmr-jpw-e-1139188.pdf; Supplier 1: TME; Supplier 2: RS Components; Supplier 3: Farnell; Supplier 4: Mouser; Supplier Part Number 4: 755-PMR01ZZPJ000; Supplier 5: Digi-Key; Supplier Part Number 5: RHM1692-6-ND
R10 R18-R20 = R_1k_0402_1: as R21 on sheet MCU; Part Number: R_1k_0402_1; HelpURL: http://www.tme.eu/pl/Document/1a2bc76e2be68b3b1670068306778ce6/rc0402yageo.pdf; Supplier 1: TME; Supplier Part Number 1: RC0402FR-071K; Supplier 2: RS Components; Supplier 3: Farnell; Supplier Part Number 3: 9239235; Supplier 4: Mouser; Supplier Part Number 4: 603-RC0402FR-071KP; Supplier 5: Digi-Key; Supplier Part Number 5: 311-1.00KLRCT-ND
R12 = R_10k_0402_1: Manufacturer: Yageo; Manufacturer Part Number: RC0402FR-0710KL; Voltage: 50V; Power: 63mW; Tolerance: 1%; Part Number: R_10k_0402_1; HelpURL: http://www.tme.eu/pl/Document/1a2bc76e2be68b3b1670068306778ce6/rc0402yageo.pdf; Supplier 1: TME; Supplier Part Number 1: RC0402FR-0710K; Supplier 2: RS Components; Supplier 3: Farnell; Supplier 4: Mouser; Supplier 5: Digi-Key
R17 = R_470R_0402_1: as R3 on sheet PSU; Part Number: R_470R_0402_1; HelpURL: http://datasheet.octopart.com/RC0402FR-07470RL-Yageo-datasheet-10408619.pdf; Supplier 1: TME; Supplier Part Number 1: RC0402FR-07470R; Supplier 2: RS Components; Supplier 3: Farnell; Supplier Part Number 3: 9239197; Supplier 4: Mouser; Supplier Part Number 4: 603-RC0402FR-07470RL; Supplier 5: Digi-Key; Supplier Part Number 5: 311-470LRCT-ND
U4 = AD8495: Precision Thermocouple Amplifiers / with Cold Junction Compensation
U5 = OPA2342: Wzmacniacz operacyjny; 1MHz; 2,7÷5,5V; Kanały: 2; SO8

## Sheet peripherals.SchDoc
size A4
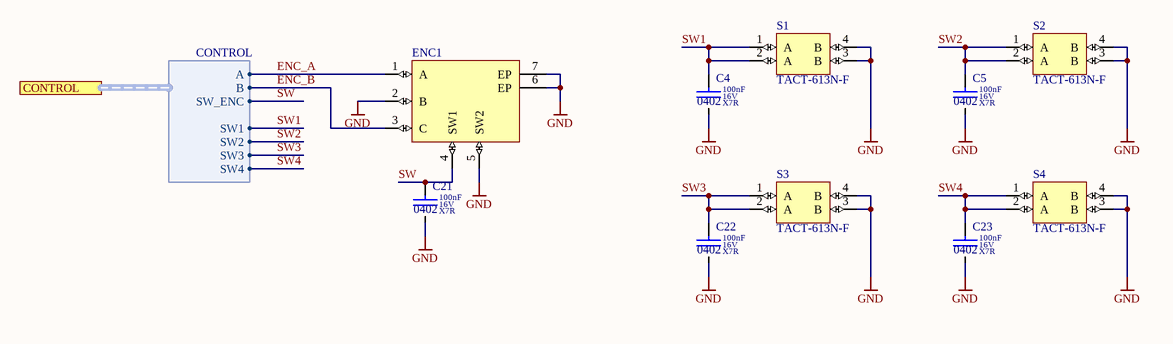
[diagram p5: peripherals.SchDoc]

### Parts
C4  value 100nF  Dielectric: X7R  Voltage: 16V  SCH_Footprint: 0402  [C_0402_1005]  (hidden comment: Ceramic X7R)
C5  value 100nF  Dielectric: X7R  Voltage: 16V  SCH_Footprint: 0402  [C_0402_1005]  (hidden comment: Ceramic X7R)
C21  value 100nF  Dielectric: X7R  Voltage: 16V  SCH_Footprint: 0402  [C_0402_1005]  (hidden comment: Ceramic X7R)
C22  value 100nF  Dielectric: X7R  Voltage: 16V  SCH_Footprint: 0402  [C_0402_1005]  (hidden comment: Ceramic X7R)
C23  value 100nF  Dielectric: X7R  Voltage: 16V  SCH_Footprint: 0402  [C_0402_1005]  (hidden comment: Ceramic X7R)
ENC1  Wurth Elektronik 482016514001  [ENCODER]  (value not drawn)
S1  TACT-613N-F  [TACT-613N-F]
S2  TACT-613N-F  [TACT-613N-F]
S3  TACT-613N-F  [TACT-613N-F]
S4  TACT-613N-F  [TACT-613N-F]

### Ports
CONTROL (harness CONTROL)

### Harnesses
CONTROL: A, B, SW_ENC, SW1, SW2, SW3, SW4

### Nets
GND: C4.2 C5.2 C21.2 C22.2 C23.2 ENC1.2(B) ENC1.5(SW2) ENC1.6(EP) ENC1.7(EP) S1.3(B) S1.4(B) S2.3(B) S2.4(B) S3.3(B) S3.4(B) S4.3(B) S4.4(B)
ENC_A: ENC1.1(A) ; port CONTROL.A
ENC_B: ENC1.3(C) ; port CONTROL.B
SW: C21.1 ENC1.4(SW1) ; port CONTROL.SW_ENC
SW1: C4.1 S1.1(A) S1.2(A) ; port CONTROL.SW1
SW2: C5.1 S2.1(A) S2.2(A) ; port CONTROL.SW2
SW3: C22.1 S3.1(A) S3.2(A) ; port CONTROL.SW3
SW4: C23.1 S4.1(A) S4.2(A) ; port CONTROL.SW4

### Library data of the parts
C4 C5 C21-C23 = C_100nF_16V_X7R_0402_10: as C2 on sheet PSU; Part Number: C_100nF_16V_X7R_0402_10; HelpURL: https://www.mouser.com/ds/2/281/c02e-2905.pdf; Supplier 1: TME; Supplier 2: RS Components; Supplier 3: Farnell; Supplier 4: Mouser; Supplier Part Number 4: 81-GRM155R71C104KA88; Supplier 5: Digi-Key
ENC1 = ENCODER

## Nets that join several sheets
3.3V: PSU (5 pins), MCU (19 pins), connectors (P1.1 P3.1), heater (9 pins)
5V: PSU (9 pins), MCU (R14.2)
GND: top (MECH1.1 MECH2.1 MECH3.1 MECH4.1), PSU (13 pins), MCU (20 pins), connectors (6 pins), heater (14 pins), peripherals (17 pins)
VIN: PSU (C3.1 C34.1 TP1.1 U3.1), connectors (J1.1), heater (Q1.3 R6.2)
ENC_A: MCU (U1.29), connectors (P4.1), peripherals (ENC1.1)
ENC_B: MCU (U1.30), connectors (P4.2), peripherals (ENC1.3)
HEATER: connectors (J2.1), heater (Q1.2)
NetR9_2: MCU (U1.11), heater (R9.2 R16.2)
NRST: MCU (C33.1 R1.1 S5.2 U1.7), connectors (P3.4)
PWM_OUT: MCU (U1.12), heater (Q2.1)
REED: MCU (R21.2 U1.13), connectors (P6.2), heater (C32.1 R10.1 R15.1)
RX: MCU (U1.43), connectors (P5.1)
SCL: MCU (R7.1 U1.45), connectors (P1.3)
SDA: MCU (R8.1 U1.46), connectors (P1.2)
SW: MCU (U1.22), connectors (P4.3), peripherals (C21.1 ENC1.4)
SW1: MCU (U1.18), connectors (P4.7), peripherals (C4.1 S1.1 S1.2)
SW2: MCU (U1.19), connectors (P4.8), peripherals (C5.1 S2.1 S2.2)
SW3: MCU (R4.1 U1.20), connectors (P4.6), peripherals (C22.1 S3.1 S3.2)
SW4: MCU (U1.21), connectors (P4.5), peripherals (C23.1 S4.1 S4.2)
SWCLK: MCU (U1.37), connectors (P3.3)
SWDIO: MCU (U1.34), connectors (P3.2)
TR: MCU (U1.10), connectors (P6.1), heater (R17.2)
TX: MCU (U1.42), connectors (P5.2)